# EAGLE design SPS (EAGLE 7.5.0)
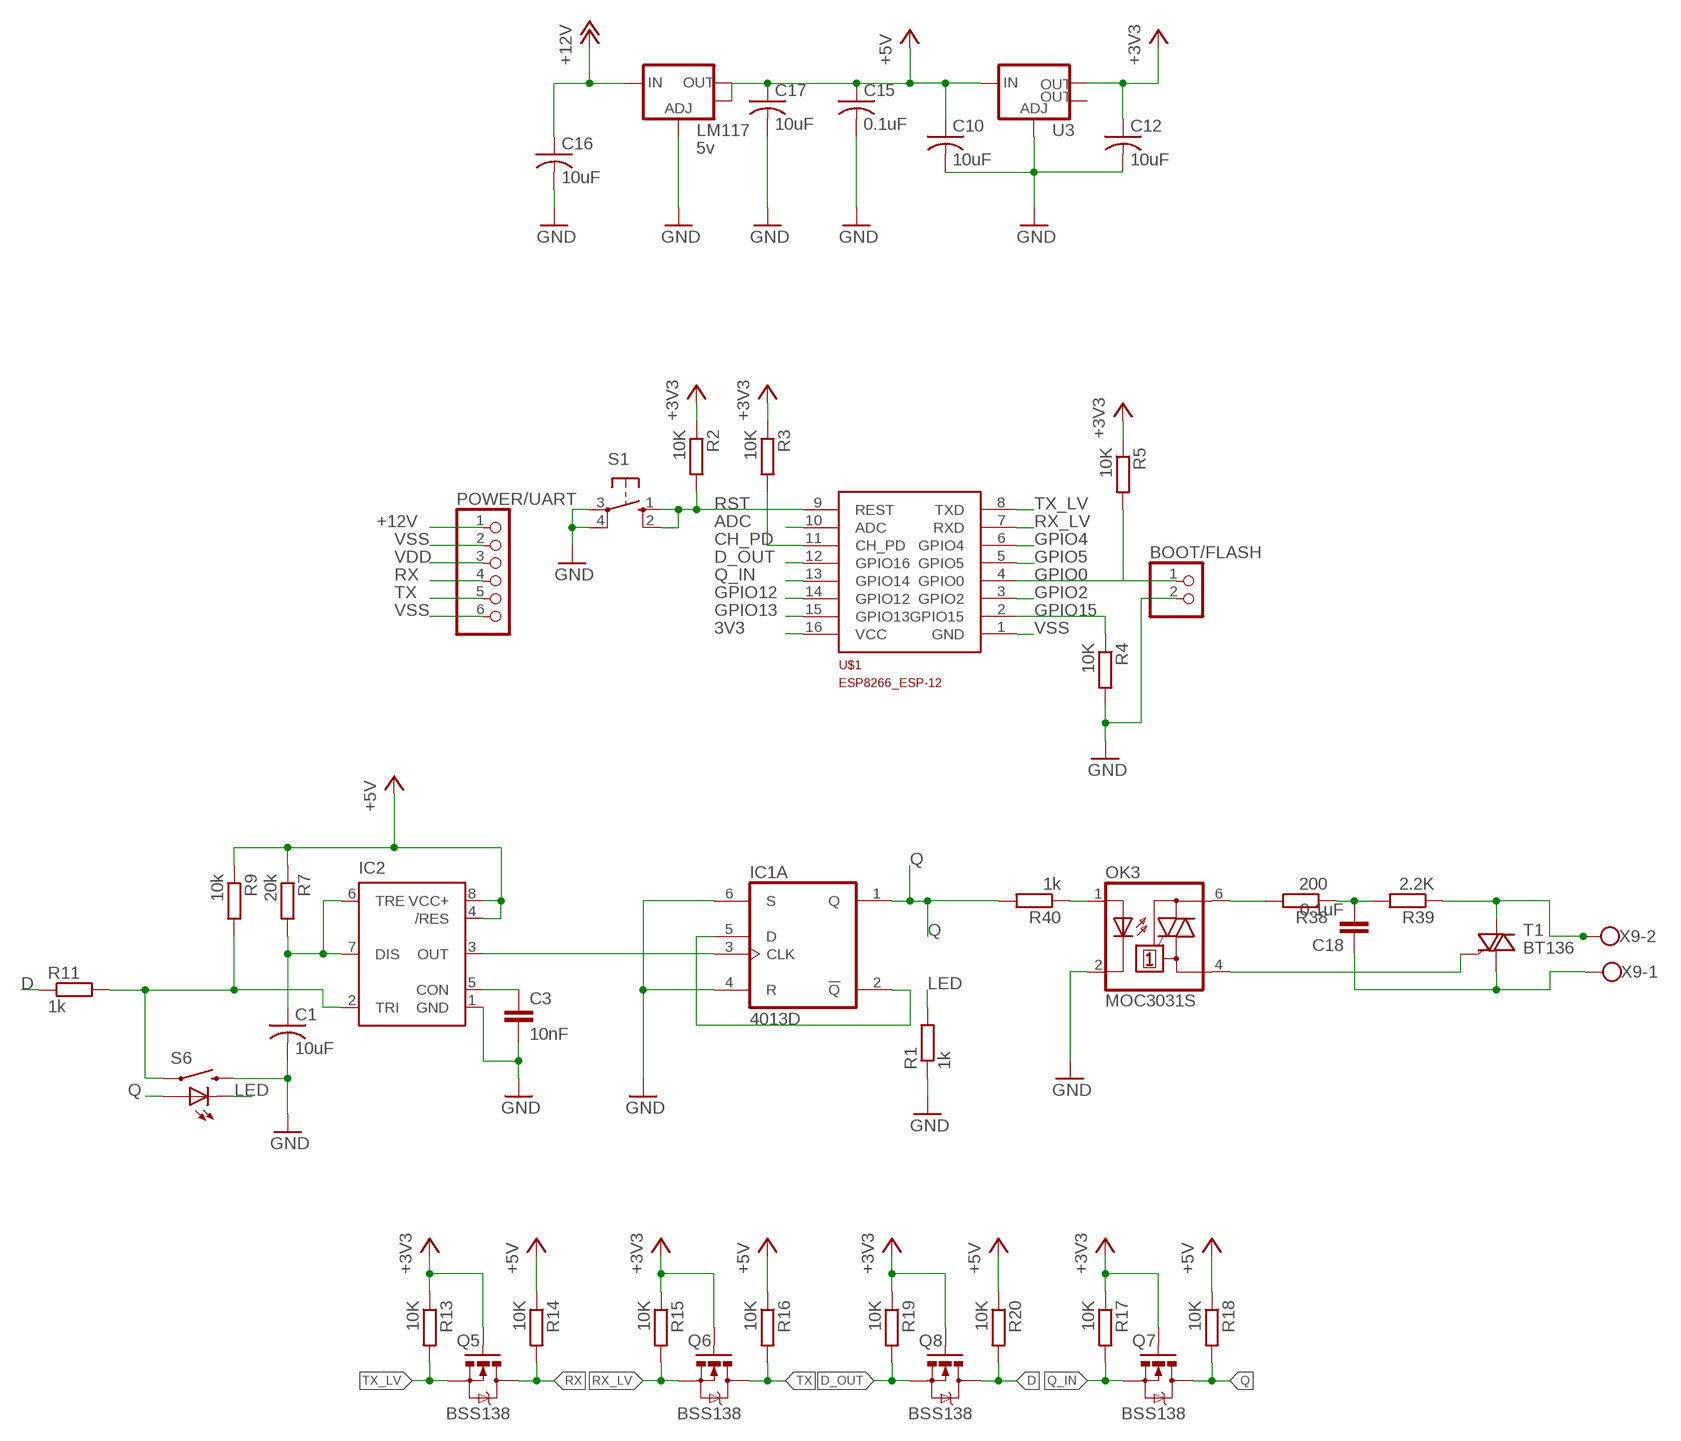
[diagram p0: schematic, sheet 1]

## Parts
BOOT/FLASH  PINHD-1X2  [1X02]
C1  10uF  C-USC1206  [C1206]
C3  10nF  C-EUC1206  [C1206]
C10  10uF  C-USC1206  [C1206]
C12  10uF  C-USC1206  [C1206]
C15  0.1uF  C-USC0805  [C0805]
C16  10uF  C-USC0805  [C0805]
C17  10uF  C-USC0805  [C0805]
C18  0.1uF  C-EU050-050X075  [C050-050X075]
IC1  4013D  [SO14]
IC2  NE555D  [SO08]
LM117  5v  V_REG_LM1117SOT223  [SOT223]
OK3  MOC3031S  [DIL6-SMD]
POWER/UART  PINHD-1X6  [1X06]
Q5  BSS138  MOSFET-NCHANNELSMD  [SOT23-3]
Q6  BSS138  MOSFET-NCHANNELSMD  [SOT23-3]
Q7  BSS138  MOSFET-NCHANNELSMD  [SOT23-3]
Q8  BSS138  MOSFET-NCHANNELSMD  [SOT23-3]
R1  1k  R-EU_R1206  [R1206]
R2  10K  R-EU_R1206  [R1206]
R3  10K  R-EU_R1206  [R1206]
R4  10K  R-EU_R1206  [R1206]
R5  10K  R-EU_R1206  [R1206]
R7  20k  R-EU_R1206  [R1206]
R9  10k  R-EU_R1206  [R1206]
R11  1k  R-EU_R1206  [R1206]
R13  10K  R-EU_R1206  [R1206]
R14  10K  R-EU_R1206  [R1206]
R15  10K  R-EU_R1206  [R1206]
R16  10K  R-EU_R1206  [R1206]
R17  10K  R-EU_R1206  [R1206]
R18  10K  R-EU_R1206  [R1206]
R19  10K  R-EU_R1206  [R1206]
R20  10K  R-EU_R1206  [R1206]
R38  200  R-EU_0414/15  [0414/15]
R39  2.2K  R-EU_0414/15  [0414/15]
R40  1k  R-EU_R1206  [R1206]
S1  10-XX  [B3F-10XX]
S6  SWITCH-MOMENTARY-LEDPTH  [TACTILE-PTH-LED-12MM]
T1  BT136  [TO220AB]
U3  V_REG_LM1117SOT223  [SOT223]
U$1  ESP8266_ESP-12  [ESP8266-ESP12]
X9  W237-102  [W237-102]

## Nets
3V3: C12.1 Q5.1(G) Q6.1(G) Q7.1(G) Q8.1(G) R2.1 R3.1 R5.1 R13.1 R15.1 R17.1 R19.1 U3.2(OUT) U$1.16(VCC) ; supply symbol labelled +3V3
+12V: C16.1 LM117.3(IN) POWER/UART.1
ADC: U$1.10(ADC)
CH_PD: R3.2 U$1.11(CH_PD)
D: Q8.3(D) R11.1 R20.2
D_OUT: Q8.2(S) R19.2 U$1.12(GPIO16)
GPIO0: BOOT/FLASH.1 R5.2 U$1.4(GPIO0)
GPIO2: U$1.3(GPIO2)
GPIO4: U$1.6(GPIO4)
GPIO5: U$1.5(GPIO5)
GPIO12: U$1.14(GPIO12)
GPIO13: U$1.15(GPIO13)
GPIO15: R4.1 U$1.2(GPIO15)
LED: R1.2 S6.C
N$1: OK3.6(A2) R38.2
N$3: C18.1 T1.1(A1) X9.1
N$8: IC1.2(A:!Q) IC1.5(A:D)
N$14: IC1.3(A:CLK) IC2.3(OUT)
N$15: C1.1 IC2.6(TRE) IC2.7(DIS) R7.2
N$18: C3.1 IC2.5(CON)
N$27: IC2.2(TRI) R9.2 R11.2 S6.4
N$52: R39.1 T1.2(A2) X9.2
N$53: OK3.4(A1) T1.3(G)
N$54: C18.2 R38.1 R39.2
N$55: OK3.1(A) R40.1
Q: IC1.1(A:Q) Q7.3(D) R18.2 R40.2 S6.A
Q_IN: Q7.2(S) R17.2 U$1.13(GPIO14)
RST: R2.2 S1.1(S) S1.2(S1) U$1.9(REST)
RX: POWER/UART.4 Q5.3(D) R14.2
RX_LV: Q6.2(S) R15.2 U$1.7(RXD)
TX: POWER/UART.5 Q6.3(D) R16.2
TX_LV: Q5.2(S) R13.2 U$1.8(TXD)
VDD: C10.1 C15.1 C17.1 IC2.4(/RES) IC2.8(VCC+) LM117.2(OUT) LM117.4(OUT) POWER/UART.3 R7.1 R9.1 R14.1 R16.1 R18.1 R20.1 U3.3(IN) ; supply symbol labelled +5V
VSS: BOOT/FLASH.2 C1.2 C3.2 C10.2 C12.2 C15.2 C16.2 C17.2 IC1.4(A:R) IC1.6(A:S) IC2.1(GND) LM117.1(ADJ) OK3.2(C) POWER/UART.2 POWER/UART.6 R1.1 R4.2 S1.3(P) S1.4(P1) S6.2 U3.1(ADJ) U$1.1(GND) ; supply symbol labelled GND
Unconnected: IC1.8(B:S) IC1.9(B:D) IC1.10(B:R) IC1.11(B:CLK) IC1.12(B:!Q) IC1.13(B:Q) U3.4(OUT)

## Power pins joined to a net without a drawn wire
VDD: IC1.14(P:VDD)
VSS: IC1.7(P:VSS)

## Library data of the parts
BOOT/FLASH = pinhead:PINHD-1X2: PIN HEADER
C1 C10 C12 = rcl:C-US: CAPACITOR, American symbol
C3 C18 = rcl:C-EU: CAPACITOR, European symbol
C15-C17 = resistor:C-US: CAPACITOR, American symbol
IC1 = 40xx:4013: Dual D FLIP FLOP, set/reset
IC2 = SparkFun-AnalogIC:NE555: General purpose bipolar Timer
LM117 = SparkFun:V_REG_LM1117: Voltage Regulator LM1117 Standard adjustable voltage regulator but in SMD form. Spark Fun Electronics SKU : COM-00595
OK3 = optocoupler:MOC30*: 6-Pin DIP Zero-Cross Optoisolators Triac Driver Output (250/400 Volt Peak) Source: Data sheet <http://www.fairchildsemi.com/ds/MO/MOC3031M.pdf> The old path of data sheet not more available 2013-05-06.; MF: FAIRCHILD SEMICONDUCTOR; MPN: MOC3031SM; OC_FARNELL: unknown; OC_NEWARK: 34C1335
POWER/UART = pinhead:PINHD-1X6: PIN HEADER
Q5-Q8 = SparkFun:MOSFET-NCHANNEL
R1-R5 R7 R9 R11 R13-R20 R40 = rcl:R-EU_: RESISTOR, European symbol
R38 R39 = resistor:R-EU_: RESISTOR, European symbol
S1 = switch-omron:10-XX: OMRON SWITCH; MPN: B3F-1000; OC_FARNELL: 176432; OC_NEWARK: 36M3542
S6 = Local Library:SWITCH-MOMENTARY-LED
T1 = triac:BT136: Triac BT136 series E sensitive gate Source: http://www.nxp.com/acrobat_download/datasheets/BT136_SERIES_E_2.pdf
U3 = SparkFun-PowerIC:V_REG_LM1117: Voltage Regulator LM1117 Standard adjustable voltage regulator but in SMD form. Spark Fun Electronics SKU : COM-00595; PROD_ID: VREG-08170
U$1 = ESP8266-ESP12:ESP8266_ESP-12
X9 = con-wago-500:W237-102: WAGO SCREW CLAMP; MPN: 237-102; OC_FARNELL: unknown; OC_NEWARK: 70K9898

## Board
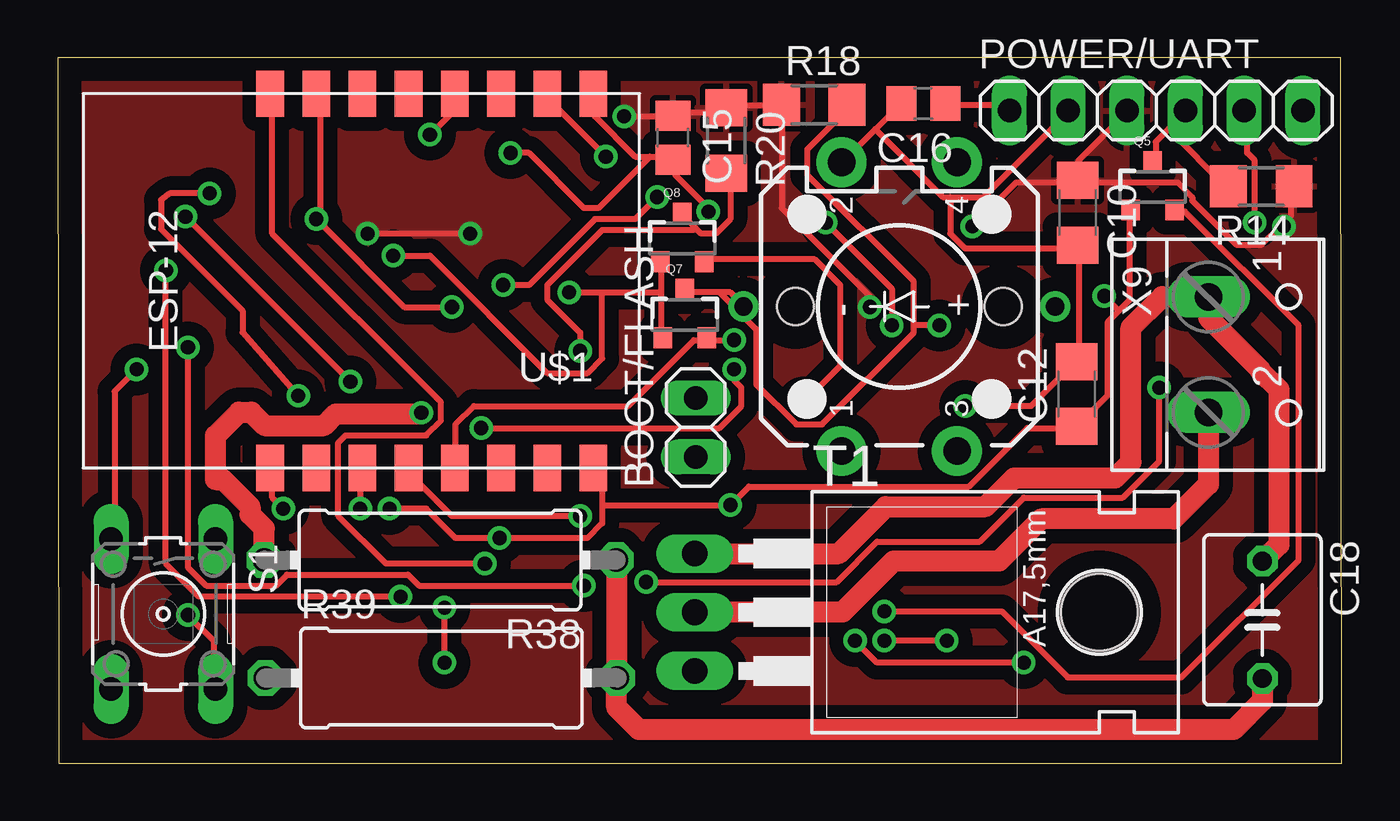
[diagram p1: board, top side]
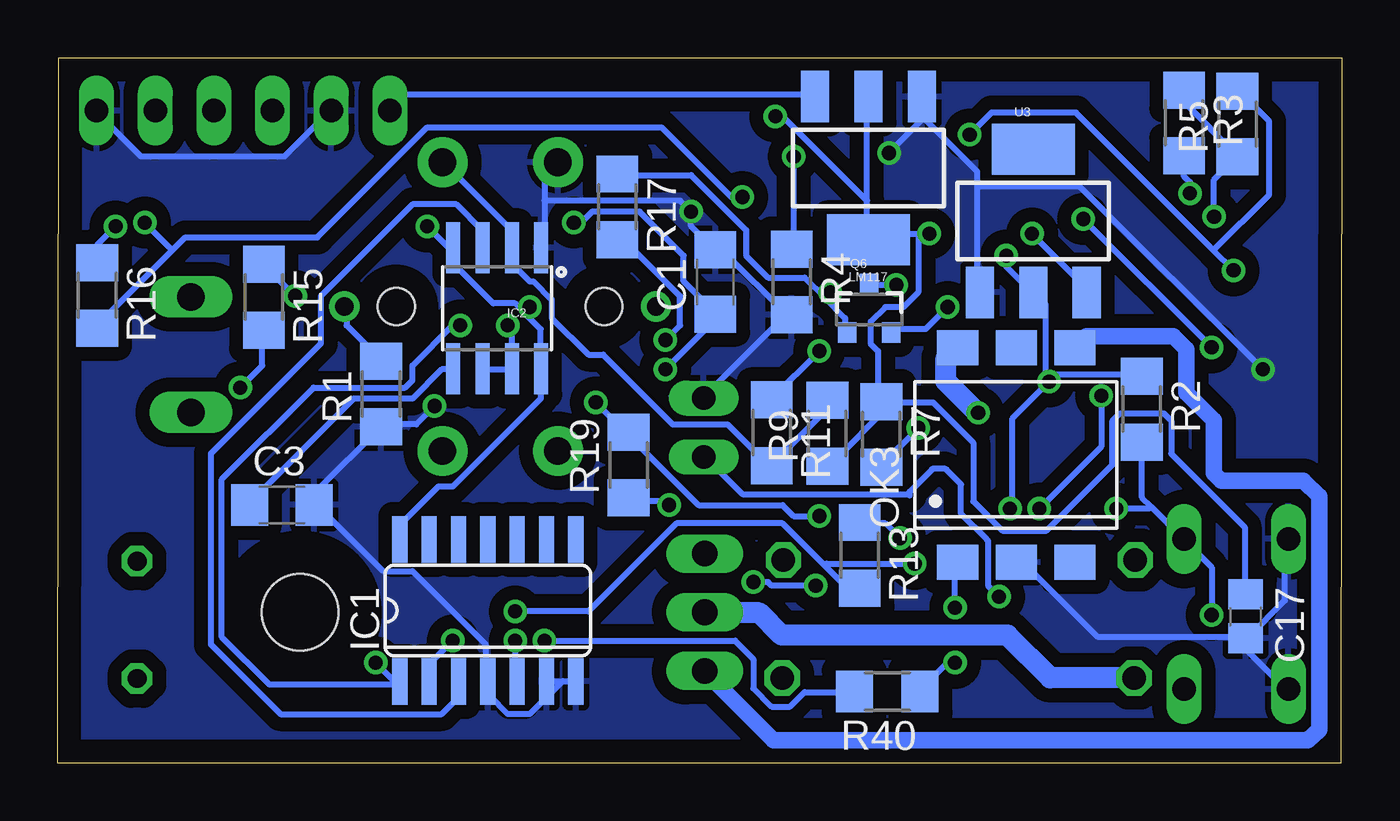
[diagram p2: board, bottom side, seen from below]

Size 55.61 x 30.53 mm. Coordinates in mm from the lower left corner, seen from the top.
Outline: 0.05,0 55.61,0 55.56,30.53 0,30.53 0.05,0
Copper layers (1*16): Top 0.035mm / dielectric 1.5mm / Bottom 0.035mm
Design rules "default": minimum track width 10mil, minimum drill 24mil, track to track 8mil, track to pad 8mil, pad to pad 8mil, via to via 8mil, smd to smd 8mil, copper to edge 40mil, drill to drill 8mil, minimum pad ring 10mil, minimum via ring 8mil, stop-mask expansion 4mil, vias tented up to drill 0mil, thermal gap 10mil

### Footprints (pad centres in the part's own frame; a part is rotated, then mirrored left to right if it is on the bottom)
1X02 = drill 1.016 long: 1 -1.27,0; 2 1.27,0
C1206 = smd 1.6 x 1.8: 1 -1.4,0; 2 1.4,0
C0805 = smd 1.3 x 1.5: 1 -0.95,0; 2 0.95,0
C050-050X075 = drill 0.813 octagon: 1 -2.54,0; 2 2.54,0
SO14 = smd 0.66 x 2.032: 1 -3.81,-3.073; 2 -2.54,-3.073; 3 -1.27,-3.073; 4 0,-3.073; 5 1.27,-3.073; 6 2.54,-3.073; 7 3.81,-3.073; 8 3.81,3.073; 9 2.54,3.073; 10 1.27,3.073; 11 0,3.073; 12 -1.27,3.073; 13 -2.54,3.073; 14 -3.81,3.073
SO08 = smd 0.61 x 2.21: 1 -1.905,-2.616; 2 -0.635,-2.616; 3 0.635,-2.616; 4 1.905,-2.616; 5 1.905,2.616; 6 0.635,2.616; 7 -0.635,2.616; 8 -1.905,2.616
SOT223 = smd 1.219 x 2.235: 1 -2.311,-3.099; 2 0,-3.099; 3 2.311,-3.099 | smd 3.6 x 2.2: 4 0,3.099
DIL6-SMD = smd 1.78 x 1.52: 1 -2.54,-4.645; 2 0,-4.645; 3 2.54,-4.645; 4 2.54,4.645; 5 0,4.645; 6 -2.54,4.645
1X06 = drill 1.016 long: 1 -6.35,0; 2 -3.81,0; 3 -1.27,0; 4 1.27,0; 5 3.81,0; 6 6.35,0
SOT23-3 = smd 0.8 x 0.9: 1 -0.95,-1; 2 0.95,-1; 3 0,1.1
R1206 = smd 1.6 x 1.803: 1 -1.422,0; 2 1.422,0
0414/15 = drill 1.016 octagon: 1 -7.62,0; 2 7.62,0
B3F-10XX = drill 1.016 long: 1 -3.251,2.261; 2 3.251,2.261; 3 -3.251,-2.261; 4 3.251,-2.261
TACTILE-PTH-LED-12MM = drill 1.2 pad 2.159: 1 -6.25,2.5; 2 6.25,2.5; 3 -6.25,-2.5; 4 6.25,-2.5 | drill 0.8: A 0,6.75; C 0,-6.75 | hole 1.6: 0,4.5; 0,-4.5
TO220AB = drill 1.118 long: 1 -2.54,-6.35; 2 0,-6.35; 3 2.54,-6.35 | hole 3.302: 0,11.176
ESP8266-ESP12 = smd 2 x 1.2: 1 16.2,2; 2 16.2,4; 3 16.2,6; 4 16.2,8; 5 16.2,10; 6 16.2,12; 7 16.2,14; 8 16.2,16; 9 0,16; 10 0,14; 11 0,12; 12 0,10; 13 0,8; 14 0,6; 15 0,4; 16 0,2
W237-102 = drill 1.194 long: 1 -2.5,-1.27; 2 2.5,-1.27

### Placement (x,y rotation side)
BOOT/FLASH  27.64,14.53 90 top
C1  27.13,20.83 90 bottom
C3  45.9,11.18 0 bottom
C10  44.17,23.83 270 top
C12  44.12,15.98 90 top
C15  26.64,27.08 270 top
C16  37.49,28.55 180 top
C17  4.17,6.35 270 bottom
C18  52.17,6.2 270 top
IC1  36.98,6.6 0 bottom
IC2  36.58,19.68 180 bottom
LM117  20.5,25.76 180 bottom
OK3  14.1,13.34 0 bottom
POWER/UART  47.57,28.24 0 top
Q5  47.42,24.94 0 top
Q6  20.47,19.63 0 bottom
Q7  27.15,19.41 0 top
Q8  27.05,22.71 0 top
R1  41.61,15.98 90 bottom
R2  8.66,15.32 270 bottom
R3  6.83,27.71 270 bottom
R4  23.83,20.83 270 bottom
R5  4.52,27.66 90 bottom
R7  19.94,14.22 270 bottom
R9  22.28,14.27 90 bottom
R11  24.69,14.3 270 bottom
R13  20.88,8.99 270 bottom
R14  52.12,24.97 180 top
R15  46.69,20.17 270 bottom
R16  53.9,20.24 270 bottom
R17  31.37,24.08 270 bottom
R18  32.77,28.5 0 top
R19  30.89,12.9 90 bottom
R20  28.96,26.95 270 top
R38  16.56,8.79 180 top
R39  16.61,3.68 0 top
R40  19.68,3.1 180 bottom
S1  4.57,6.45 270 top
S6  36.45,19.76 90 top
T1  33.93,6.53 270 top
U3  13.36,23.47 0 bottom
U$1  25.2,12.78 90 top
X9  51.1,17.68 270 top

### Tracks (layer width: path | path; a pad name or v marks a point on that pad's centre or on a via)
3V3  (via drill 0.61)
  Top 0.254: 26.12,20.38 26.12,21.65 Q8.1 | 26.12,20.38 26.12,18.47 Q7.1 | v22.15,20.38 23.58,20.38 | 23.58,20.38 26.12,20.38 | 45.96,19.58 45.48,19.11 45.48,15.93 44.21,14.66 C12.1 44.06,14.5 41.99,14.5 39.45,11.96 29.93,11.96 v29.13,11.17 23.58,11.17 | 45.96,19.58 46.44,20.06 46.44,23.87 Q5.1 | 45.96,19.58 v45.33,20.22 | 23.58,11.17 23.58,12.44 23.26,12.76 U$1.16 | 23.58,11.17 23.58,10.38 22.94,9.74 v19.13,9.74 17.23,9.74 15.96,11.01 v14.37,11.01 | 23.58,20.38 23.58,17.52 22.94,16.89 21.2,16.89 16.12,21.96 v14.53,21.96 | v12.67,16.51 v5.53,23.65
  Bottom 0.254: 22.39,20.14 23.26,21.01 24.85,21.01 25.8,21.96 25.8,23.08 28.18,25.46 31.36,25.46 R17.1 | 22.39,20.14 21.51,19.27 21.51,18.79 Q6.1 | 22.39,20.14 v22.15,20.38 | v45.33,20.22 46.6,21.49 R15.1 | v19.13,9.74 19.77,10.38 20.88,10.38 R13.1 | v29.13,11.17 29.29,11.33 30.88,11.33 R19.1 | v14.53,21.96 14.53,21.49 13.42,20.38 U3.2 12.83,19.84 12.83,16.83 12.67,16.83 | R3.1 6.8,29.05 6.8,28.57 4.58,26.35 R5.1 4.58,26.19 5.53,25.24 v5.53,23.65 | 12.67,16.83 8.71,16.83 R2.1 | 12.67,16.83 v12.67,16.51 14.26,14.92 14.26,11.11 v14.37,11.01
+12V
  Top 0.254: C16.1 38.5,28.47 41.04,28.47 41.2,28.32 POWER/UART.1
  Bottom 0.254: LM117.3 22.94,28.95 40.56,28.95 41.2,28.32 POWER/UART.1
CH_PD  (via drill 0.61)
  Top 0.254: v13.1,11.01 13.1,12.76 U$1.11 | v6.58,24.66 4.85,24.66 4.47,24.38 4.47,23.11 8,19.58 8,18.64 v10.41,15.9
  Bottom 0.254: v13.1,11.01 10.41,13.7 v10.41,15.9 | v6.58,24.66 6.58,25.15 6.83,25.4 R3.2
  Bottom 0.406: R3.2 6.71,26.29
D  (via drill 0.61)
  Top 0.254: 27.63,23.16 27.86,22.92 28.5,22.92 29.13,23.55 29.13,25.3 28.97,25.46 R20.2 | 27.63,23.16 27.07,23.71 Q8.3 | v22.62,17.84 22.62,18.63 21.2,20.06 21.2,20.7 23.58,23.08 27.55,23.08 27.63,23.16
  Bottom 0.254: v22.62,17.84 24.69,15.77 R11.1
D_OUT  (via drill 0.61)
  Top 0.254: v32.31,15.62 33.9,17.2 33.9,20.7 32.78,21.81 28.02,21.81 Q8.2 | v22.62,10.69 17.07,10.69 15.32,12.44 15.32,12.76 U$1.12
  Bottom 0.254: v32.31,15.62 31.04,14.35 R19.2 30.88,14.19 27.86,11.17 24.21,11.17 23.74,10.69 v22.62,10.69
GPIO0  (via drill 0.61)
  Top 0.254: v16.12,27.2 17.07,28.16 17.07,28.95 U$1.4 | v4.69,21.33 4.69,8.63 6.11,7.2 v14.85,7.2
  Bottom 0.254: BOOT/FLASH.1 27.55,13.23 25.96,11.65 18.81,11.65 18.71,11.59 18.71,11.75 17.75,12.7 17.7,12.76 17.23,12.76 17.12,12.7 16.48,12.06 16.48,10.79 15.37,9.68 15.32,9.58 15.32,7.68 v14.85,7.2 | v16.12,27.2 15.16,28.16 11.51,28.16 5.56,22.2 | v4.69,21.33 5.56,22.2 | 5.56,22.2 3.15,24.61 3.15,27.78 4.42,29.05 R5.2
GPIO15  (via drill 0.61)
  Top 0.254: v23.74,26.25 21.35,28.63 21.35,28.95 U$1.2
  Bottom 0.254: v23.74,26.25 23.74,22.28 R4.1
LED
  Bottom 0.254: R1.2 41.67,17.52 43.1,18.95 43.1,19.74 S6.C
N$1  (via drill 0.61)
  Top 0.914: R38.2 8.94,10.16 8.33,10.77 8.33,11.1 7.16,12.27 6.83,12.27 6.83,14.17 7.85,15.19 8.38,15.19 8.97,14.61 11.53,14.61 12.04,15.11 15.7,15.11 v15.75,15.16 15.72,15.19
  Bottom 0.914: v15.75,15.16 15.77,15.16 17.14,16.54 17.14,17.47 OK3.6
N$3
  Top 0.914: C18.1 52.88,9.45 52.88,16.18 52.07,16.99 52.07,17.04 49.83,19.28 X9.1 49.82,20.19 47.83,20.19 46.48,18.85 46.48,13.03 45.8,12.34 41.43,12.34 40.18,11.1 35.86,11.1 33.83,9.07 T1.1
N$8  (via drill 0.61)
  Top 0.254: v38.5,5.3 v35.8,5.3
  Bottom 0.254: v35.8,5.3 35.8,3.55 IC1.5 | v38.5,5.3 39.45,4.34 39.45,3.55 IC1.2
N$14
  Bottom 0.254: IC1.3 38.34,3.39 38.34,2.76 38.98,2.12 45.96,2.12 48.98,5.14 48.98,13.39 44.21,18.16 44.21,20.22 40.25,24.19 38.34,24.19 37.23,23.08 37.23,22.44 IC2.3
N$15  (via drill 0.61)
  Top 0.254: v29.29,17.04 29.29,16.57 29.61,16.25 29.61,15.46 28.66,14.5 v18.34,14.5 | v36.12,18.95 36.12,20.54 v33.26,23.39
  Bottom 0.254: IC2.6 37.07,17.04 35.96,17.04 IC2.7 35.96,17.2 35.96,18.79 v36.12,18.95 | v29.29,17.04 27.23,19.11 27.23,19.43 C1.1 27.23,19.58 28.5,20.85 28.5,21.96 30.4,23.87 32.47,23.87 32.94,23.39 v33.26,23.39 | v18.34,14.5 19.93,12.92 R7.2
N$18
  Bottom 0.254: C3.1 47.23,11.33 42.79,15.77 40.25,15.77 38.98,17.04 38.5,17.04 IC2.5
N$27
  Bottom 0.254: R9.2 22.31,15.62 22.31,15.3 24.69,12.92 R11.2 24.69,13.07 25.01,13.07 26.59,14.66 28.97,14.66 31.99,17.68 32.63,17.68 34.21,19.27 34.21,20.06 35.01,20.85 35.17,20.85 35.8,21.49 35.8,22.28 IC2.2 35.96,22.44 35.96,23.08 38.82,25.93 S6.4
N$52
  Top 0.914: X9.2 49.83,12.06 48.34,10.57 42.6,10.57 40.77,8.74 36.19,8.74 33.99,6.53 T1.2
  Bottom 0.914: R39.1 12.62,3.68 14.48,5.54 24.26,5.54 25.22,6.5 27.56,6.5 T1.2
N$53
  Bottom 0.711: T1.3 27.58,3.96 24.61,0.99 1.47,0.99 0.97,1.45 0.97,11.56 1.68,12.22 5.21,12.22 5.54,12.55 5.54,14.83 6.73,16.03 6.73,17.91 7.29,18.47 11.07,18.47 OK3.4
N$54
  Top 0.914: C18.2 52.17,2.69 50.93,1.45 25.17,1.45 24.21,2.41 24.21,3.66 R39.2 24.23,8.74 R38.1
N$55  (via drill 0.61)
  Top 0.254: v16.75,4.34 v16.75,6.72
  Bottom 0.254: v16.75,6.72 16.75,8.63 OK3.1 | v16.75,4.34 17.07,4.34 18.18,3.23 R40.1
Q  (via drill 0.61)
  Top 0.254: 28.66,20.38 29.13,20.38 29.61,19.9 S6.A | 28.66,20.38 27.23,20.38 Q7.3 | 37.07,18.95 37.07,18.63 33.1,14.66 31.99,14.66 30.24,16.41 30.24,18.79 28.66,20.38 | 37.07,18.95 37.07,20.85 32.47,25.46 32.47,26.57 34.05,28.16 34.05,28.47 R18.2 | v34.53,5.3 35.48,4.34 v41.83,4.34 | v38.18,18.95 37.07,18.95
  Bottom 0.254: v34.53,5.3 26.28,5.3 25.48,4.5 25.48,3.23 24.69,2.44 23.89,2.44 23.26,3.07 21.2,3.07 R40.2 | v41.83,4.34 40.88,3.39 IC1.1 41.04,3.39 46.44,3.39 48.5,5.46 48.5,12.28 44.53,16.25 40.56,16.25 40.25,16.57 40.25,17.2 38.5,18.95 v38.18,18.95
Q_IN  (via drill 0.61)
  Top 0.254: U$1.13 17.23,12.92 17.23,14.66 18.02,15.46 24.69,15.46 27.55,18.31 28.02,18.31 Q7.2 28.18,18.31 v29.29,18.31
  Bottom 0.254: v29.29,18.31 28.66,18.95 28.66,20.22 31.04,22.6 31.36,22.6 R17.2
RST  (via drill 0.61)
  Top 0.254: v9.77,11.01 9.29,11.49 9.29,12.76 U$1.9 | v5.64,6.41 6.75,5.3 6.75,3.23 S1.2
  Bottom 0.254: 8.26,11.09 6.91,9.74 S1.1 6.75,9.58 5.64,8.47 v5.64,6.41 | 8.26,11.09 8.65,11.49 8.65,13.87 R2.2 | v9.77,11.01 8.34,11.01 8.26,11.09
RX
  Top 0.254: Q5.3 47.55,26.09 47.55,26.89 48.82,28.16 POWER/UART.4 48.18,27.36 50.56,24.98 R14.2
RX_LV  (via drill 0.61)
  Top 0.254: v17.07,19.74 15,19.74 11.35,23.39 11.35,23.55 | 11.35,23.55 11.35,28.95 U$1.7 | v47.71,16.25 47.71,13.07 46.12,11.49 41.83,11.49 39.93,9.58 35.48,9.58 33.74,7.84 v25.48,7.84 | v22.78,7.68 15.64,7.68 15.16,8.15 9.92,8.15 9.45,7.68 6.43,7.68 5.64,8.47 v5.64,18 | 11.35,23.55 v11.19,23.55
  Bottom 0.254: v17.07,19.74 18.02,18.79 19.45,18.79 Q6.2 | v47.71,16.25 46.75,17.2 46.75,18.63 R15.2 | v25.48,7.84 24.85,7.84 24.69,7.68 v22.78,7.68 | v11.19,23.55 v5.64,18
TX  (via drill 0.61)
  Top 0.254: v19.29,20.7 20.4,20.7 23.26,23.55 25.01,23.55 v25.96,24.5 | v51.83,23.39 51.83,26.09 51.52,26.41 51.52,28.16 POWER/UART.5
  Bottom 0.254: v19.29,20.7 20.4,20.7 Q6.3 | v25.96,24.5 26.43,24.5 29.45,27.52 39.61,27.52 44.37,22.76 50.09,22.76 50.64,22.2 | 50.64,22.2 53.9,18.95 R16.2 | 50.64,22.2 v51.83,23.39
TX_LV  (via drill 0.61)
  Top 0.254: v35.8,6.57 40.88,6.57 43.74,3.71 48.66,3.71 53.74,8.79 53.74,18.95 48.82,23.87 48.5,23.87 Q5.2 | v18.5,8.63 14.21,8.63 12.15,10.69 12.15,13.87 12.46,14.19 15.96,14.19 16.59,14.82 16.59,15.62 9.29,22.92 9.29,28.95 U$1.8
  Bottom 0.254: v35.8,6.57 32.63,6.57 28.82,10.38 24.21,10.38 22.39,8.55 | 22.39,8.55 21.51,7.68 20.88,7.68 R13.2 | v18.5,8.63 22.31,8.63 22.39,8.55
VDD  (via drill 0.61)
  Top 0.254: C10.1 44.21,25.3 44.21,26.09 46.28,28.16 POWER/UART.3 | 53.03,23.31 52.15,22.44 51.04,22.44 49.14,24.35 49.14,24.5 48.5,25.14 44.21,25.14 C10.1 | 53.03,23.31 53.42,23.71 53.42,24.82 R14.1 | v53.1,23.23 53.03,23.31 | v39.61,23.23 41.52,25.14 44.06,25.14 C10.1 | v17.86,22.92 v13.42,22.92 | v24.53,28 26.59,28 C15.1 26.75,28.16 28.66,28.16 28.82,28.32 R20.1 28.97,28.47 31.2,28.47 R18.1 31.36,28.47 31.36,24.03 35.17,20.22 v35.17,19.74
  Bottom 0.254: R16.1 53.9,22.44 v53.1,23.23 | IC1.14 40.72,9.74 40.72,10.38 39.13,11.96 38.5,11.96 34.69,15.77 34.69,17.04 IC2.8 34.69,17.2 34.69,18.79 35.4,19.5 | 38.34,21.96 38.34,21.49 36.75,19.9 35.8,19.9 35.4,19.5 | 38.34,21.96 38.34,22.28 IC2.4 38.34,21.96 | 38.34,21.96 v39.61,23.23 | 19.45,15.62 19.93,15.62 R7.1 | 19.45,15.62 17.7,15.62 15.96,13.87 15.96,11.33 14.69,10.06 12.78,10.06 9.92,12.92 9.92,14.82 9.61,15.14 7.7,15.14 7.38,14.82 7.38,13.39 4.21,10.22 4.21,7.36 C17.1 | 19.45,15.62 22.15,12.92 R9.1 | 19.45,15.62 R7.1 | v13.42,22.92 11.19,20.7 11.19,20.38 U3.3 | 18.34,22.92 20.24,22.92 20.4,22.76 LM117.4 20.56,22.76 20.56,24.35 | 20.56,24.35 20.56,28.79 LM117.2 | v24.53,28 24.21,28 20.56,24.35 | 18.34,22.92 18.34,20.38 18.97,19.74 19.77,19.74 20.4,19.11 20.4,18.16 20.08,17.84 20.08,15.77 R7.1 | 18.34,22.92 v17.86,22.92 | v35.17,19.74 35.4,19.5
  pour Top (isolate 0.61): 0,30.53 0,30.48 0.05,0 55.6,0 55.6,0.08 55.55,30.53
VSS  (via drill 0.61)
  Top 0.254: 35.4,27.44 34.05,26.09 S6.2 | 35.4,27.44 36.44,28.47 C16.2 | 38.66,24.5 38.34,24.5 35.4,27.44 | 38.66,24.5 40.09,24.5 43.74,28.16 POWER/UART.2 | 38.66,24.5 38.66,22.92 39.29,22.28 44.06,22.28 C10.2 44.21,22.28 44.21,17.52 C12.2 44.06,17.36 42.15,15.46 v39.29,15.46 | 25.64,26.25 25.01,26.25 23.26,28 23.26,28.95 U$1.1 | 25.64,26.25 26.59,26.25 C15.2 26.75,26.09 26.75,25.46 28.18,24.03 v28.18,23.87 | v19.61,26.41 20.4,26.41 22.78,24.03 23.42,24.03 25.64,26.25 | v3.42,17.04 2.46,16.09 2.46,9.74 S1.3
  Bottom 0.254: 33.74,3.55 34.37,3.55 IC1.6 | 33.74,3.55 33.26,3.55 IC1.7 | 33.74,3.55 35.17,2.12 36.12,2.12 36.91,2.92 36.91,3.39 IC1.4 37.07,3.55 37.07,5.14 40.25,8.31 41.52,8.31 44.37,11.17 C3.2 44.37,11.33 44.37,11.8 41.67,14.5 R1.1 41.52,14.66 40.09,14.66 v39.29,15.46 | 34.53,24.35 34.53,25.46 34.05,25.93 S6.2 | 34.53,24.35 34.53,22.44 IC2.1 | POWER/UART.6 53.9,28.16 51.99,26.25 45.8,26.25 43.9,28.16 POWER/UART.2 | C17.2 4.05,5.3 4.05,4.82 2.46,3.23 S1.4 | OK3.2 14.05,8.63 13.73,8.63 10.56,5.46 4.21,5.46 C17.2 | S1.3 2.46,9.58 2.46,7.04 4.05,5.46 C17.2 | 15.8,24.98 15.8,25.62 18.18,28 18.18,28.79 LM117.1 18.18,27.84 v19.61,26.41 | 15.8,24.98 15.8,20.38 U3.1 | 24.05,19.43 23.89,19.27 R4.2 24.05,19.43 | 24.05,19.43 26.75,22.12 27.07,22.12 C1.2 27.23,22.28 28.18,23.23 v28.18,23.87 28.66,24.35 34.53,24.35 | 24.05,19.43 27.55,15.93 BOOT/FLASH.2 | v3.42,17.04 11.35,24.98 15.8,24.98
  pour Bottom (isolate 0.61): 0,30.51 0,30.45 0.05,-0.03 55.6,-0.03 55.6,0.05 55.55,30.51